# EAGLE board Schematic_BG96_Mega2560 (EAGLE 9.5.2), part 1 of 2
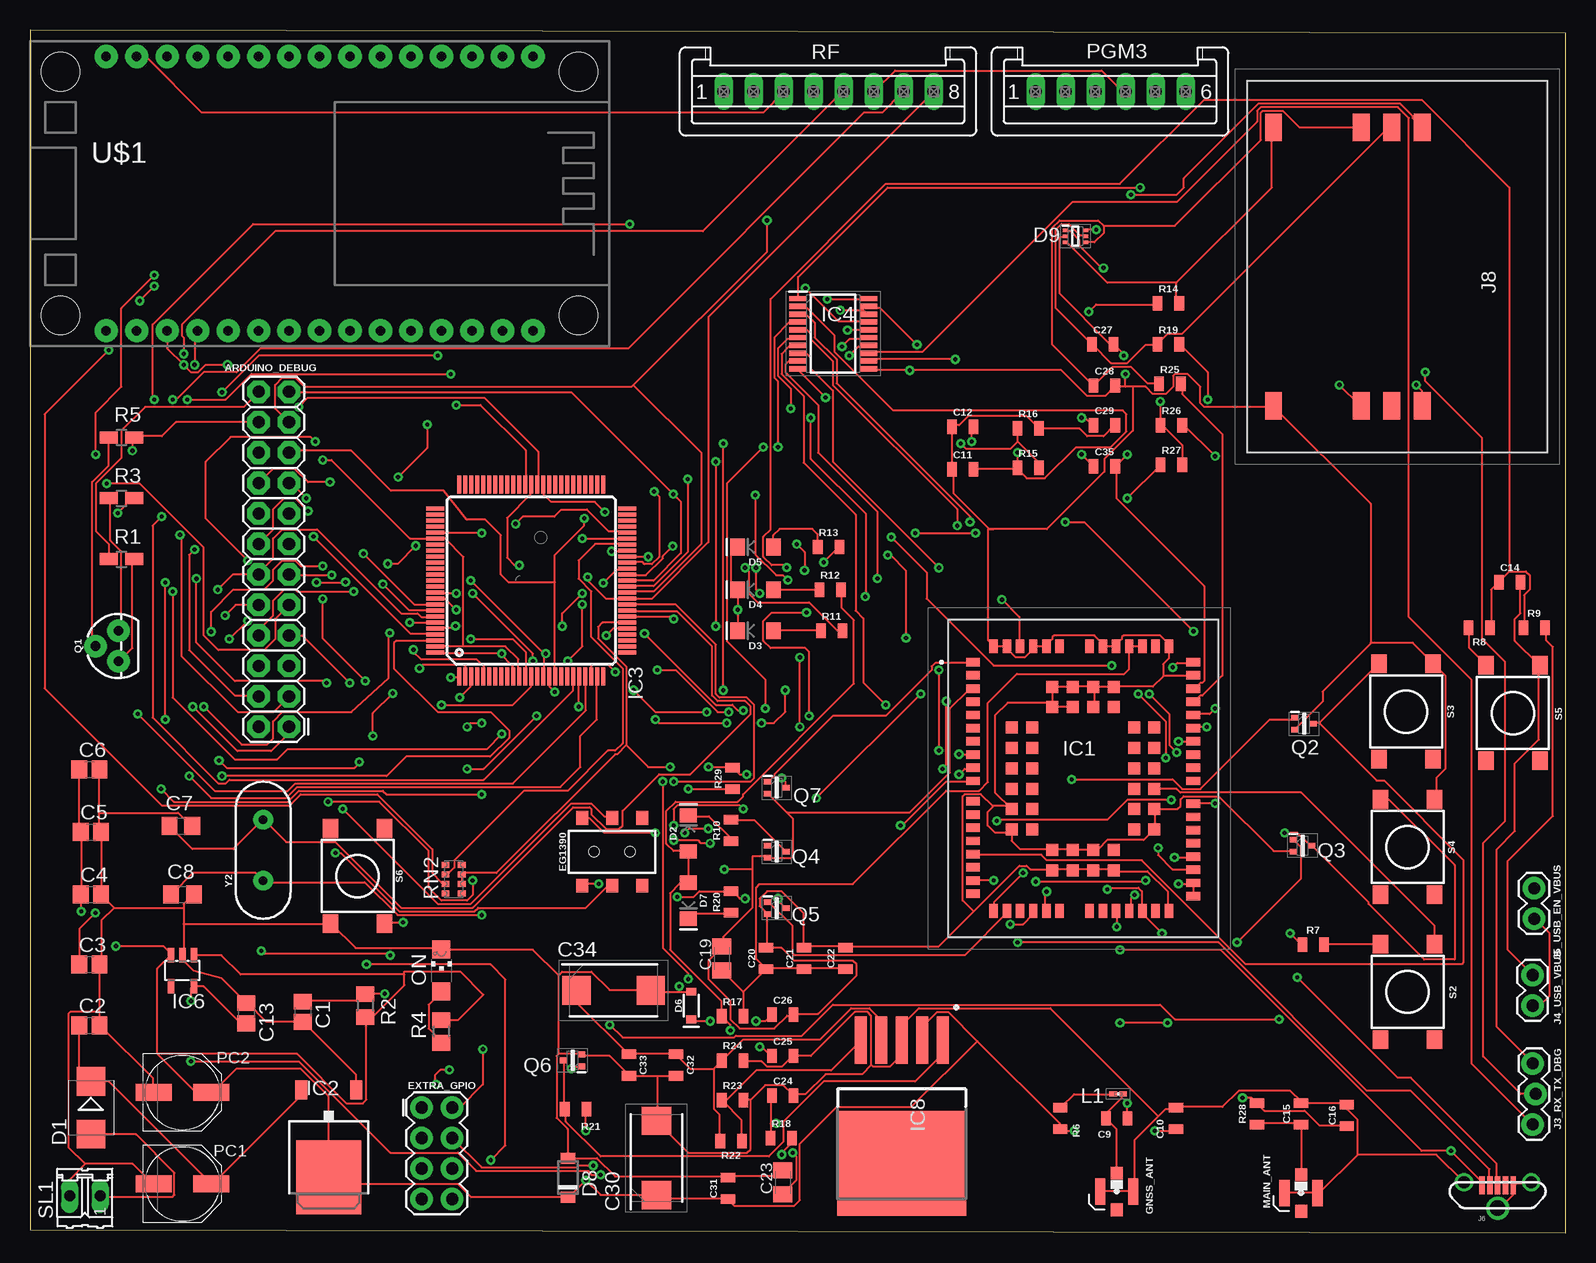
[diagram p2: board, top side]
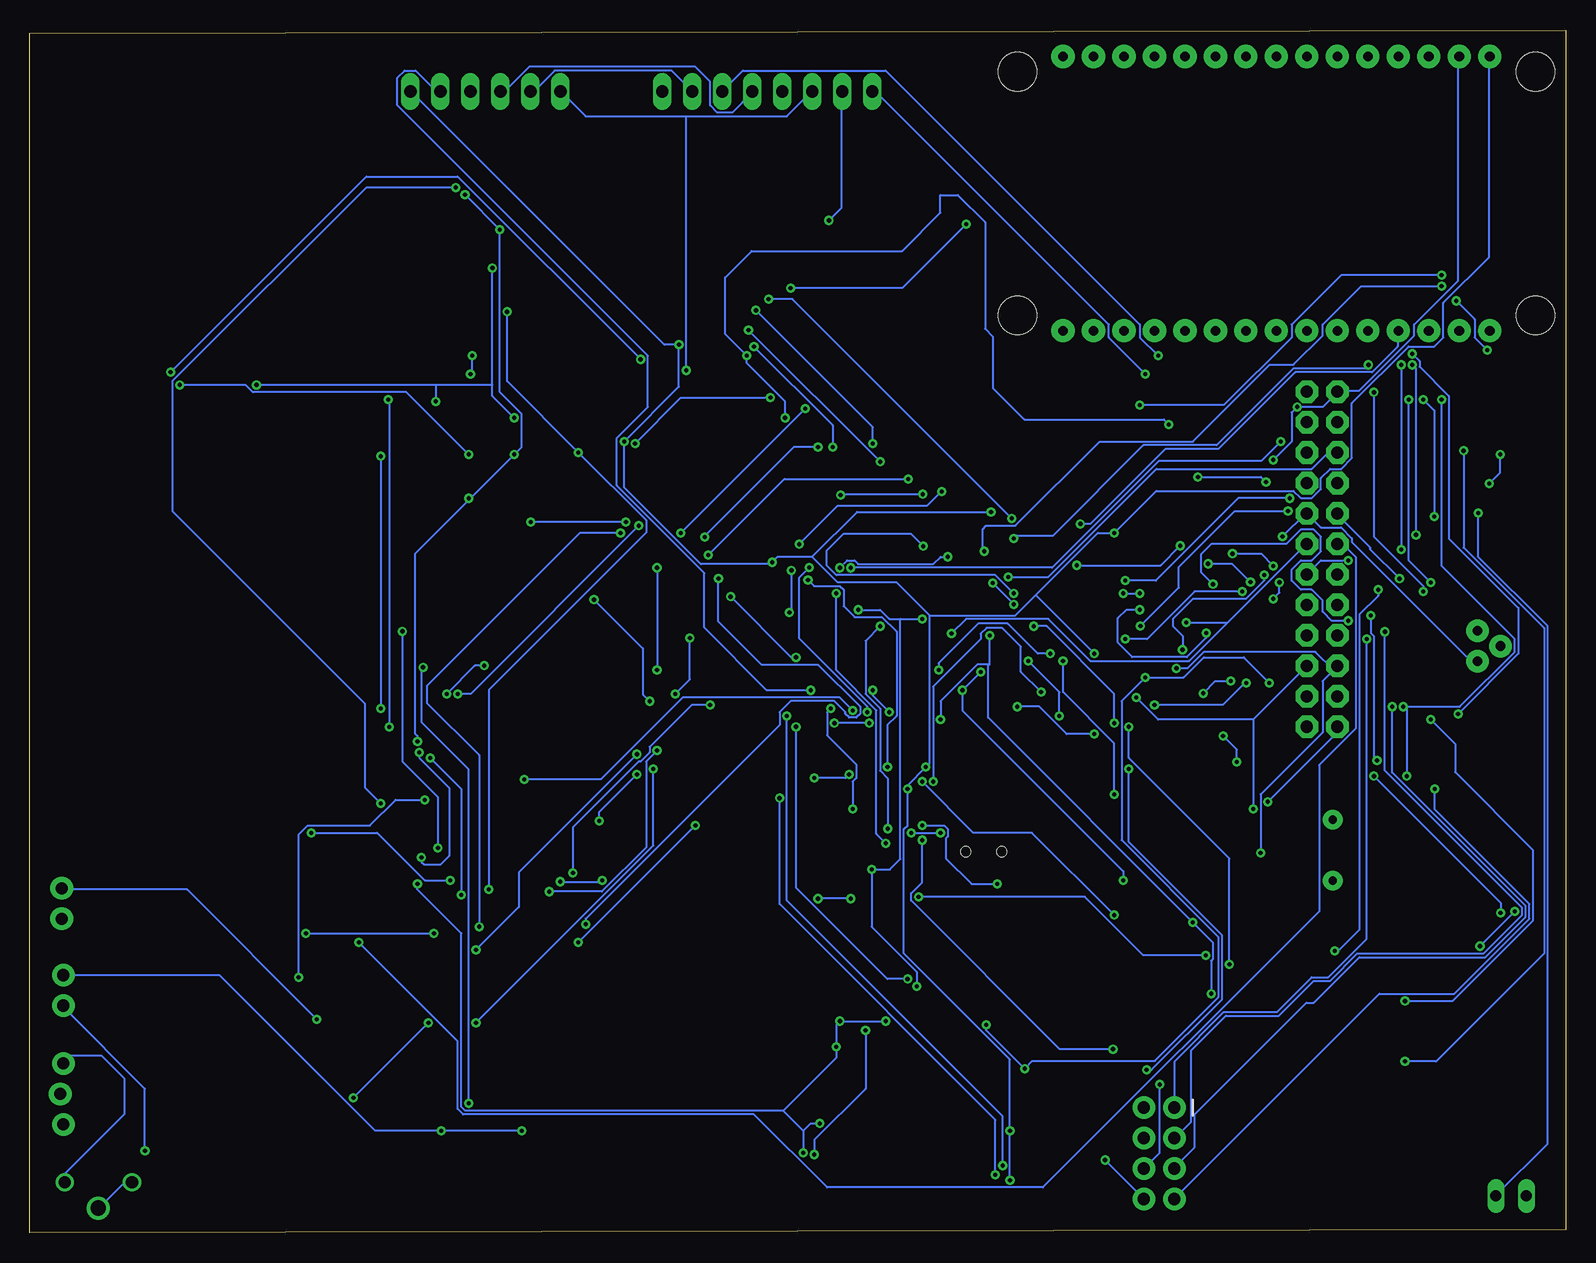
[diagram p3: board, bottom side, seen from below]

Size 128 x 100.25 mm. Coordinates in mm from the lower left corner, seen from the top.
Outline: 0,0.25 128,0 128,100 0,100.25 0,0.25
Copper layers (1*16): Top 0.035mm / dielectric 1.5mm / Bottom 0.035mm
Design rules "default *": minimum track width 6mil, minimum drill 0.35mm, track to track 6mil, track to pad 6mil, pad to pad 6mil, via to via 6mil, smd to smd 6mil, copper to edge 40mil, drill to drill 6mil, minimum pad ring 10mil, minimum via ring 8mil, stop-mask expansion 4mil, vias tented up to drill 0mil, thermal gap 10mil

## Footprints (pad centres in the part's own frame; a part is rotated, then mirrored left to right if it is on the bottom)
2X12 = drill 1.016 pad 1.88 octagon: 1 0,0; 2 0,2.54; 3 2.54,0; 4 2.54,2.54; 5 5.08,0; 6 5.08,2.54; 7 7.62,0; 8 7.62,2.54; 9 10.16,0; 10 10.16,2.54; 11 12.7,0; 12 12.7,2.54; 13 15.24,0; 14 15.24,2.54; 15 17.78,0; 16 17.78,2.54; 17 20.32,0; 18 20.32,2.54; 19 22.86,0; 20 22.86,2.54; 21 25.4,0; 22 25.4,2.54; 23 27.94,0; 24 27.94,2.54
C0805 = smd 1.3 x 1.5: 1 -0.85,0; 2 0.85,0
C0805' = smd 1.3 x 1.5: 1 -0.95,0; 2 0.95,0
0805 = smd 0.8 x 1.2: 1 -0.9,0; 2 0.9,0
C0805K = smd 1.3 x 1.6: 1 -1,0; 2 1,0
CAPPM7343X310N = smd 2.35 x 2.45: 1 -3.1,0; 2 3.1,0
SMB = smd 2.4 x 2.4: A 2.2,0; C -2.2,0
LED-1206 = smd 1.2 x 1.4: A -1.5,0; C 1.5,0
SOD-323 = smd 0.63 x 0.83: A 1.15,0; C -1.15,0
SOD123FL = smd 0.91 x 1.22: A 1.625,0; C -1.625,0
SOTFL50P160X60-6N = smd 0.475 x 0.3: 1 -0.838,0.5; 2 -0.838,0; 3 -0.838,-0.5; 4 0.838,-0.5; 5 0.838,0; 6 0.838,0.5
SWITCH_DPDT_SMD_AYZ0202 = smd 1 x 1.15: 1 -2.5,2.825; 2 0,2.825; 3 2.5,2.825; 4 -2.5,-2.825; 5 0,-2.825; 6 2.5,-2.825 | hole 0.85: 1.5,0; -1.5,0
2X4 = drill 1.016 pad 1.88: 1 -3.81,-1.27; 2 -3.81,1.27; 3 -1.27,-1.27; 4 -1.27,1.27; 5 1.27,-1.27; 6 1.27,1.27; 7 3.81,-1.27; 8 3.81,1.27
U.FL = smd 2.2 x 0.85: 1 0,1.375; 2 0,-1.375 | smd 1.05 x 1: FEED 1.525,0; NC -1.525,0
BG96MA = smd 1.15 x 0.7: 1 -9.18,9.7; 2 -9.18,8.6; 3 -9.18,7.5; 4 -9.18,6.4; 5 -9.18,5.3; 6 -9.18,4.2; 7 -9.18,3.1; 8 -9.18,2; 9 -9.18,0.9; 10 -9.18,-0.2; 11 -9.18,-1.9; 12 -9.18,-3; 13 -9.18,-4.1; 14 -9.18,-5.2; 15 -9.18,-6.3; 16 -9.18,-7.4; 17 -9.18,-8.5; 18 -9.18,-9.6; 32 9.18,-9.8; 33 9.18,-8.7; 34 9.18,-7.6; 35 9.18,-6.5; 36 9.18,-5.4; 37 9.18,-4.3; 38 9.18,-3.2; 39 9.18,-2.1; 40 9.18,-0.2; 41 9.18,0.9; 42 9.18,2; 43 9.18,3.1; 44 9.18,4.2; 45 9.18,5.3; 46 9.18,6.4; 47 9.18,7.5; 48 9.18,8.6; 49 9.18,9.7 | smd 0.7 x 1.15: 19 -7.45,-11.025; 20 -6.35,-11.025; 21 -5.25,-11.025; 22 -4.15,-11.025; 23 -3.05,-11.025; 24 -1.95,-11.025; 25 0.55,-11.025; 26 1.65,-11.025; 27 2.75,-11.025; 28 3.85,-11.025; 29 4.95,-11.025; 30 6.05,-11.025; 31 7.15,-11.025; 50 7.15,11.025; 51 6.05,11.025; 52 4.95,11.025; 53 3.85,11.025; 54 2.75,11.025; 55 1.65,11.025; 56 0.55,11.025; 57 -1.95,11.025; 58 -3.05,11.025; 59 -4.15,11.025; 60 -5.25,11.025; 61 -6.35,11.025; 62 -7.45,11.025 | smd 1 x 1: 63 -5.95,4.25; 64 -5.95,2.55; 65 -5.95,0.85; 66 -5.95,-0.85; 67 -5.95,-2.55; 68 -5.95,-4.25; 69 -2.55,-7.65; 70 -0.85,-7.65; 71 0.85,-7.65; 72 2.55,-7.65; 73 5.95,-4.25; 74 5.95,-2.55; 75 5.95,-0.85; 76 5.95,0.85; 77 5.95,2.55; 78 5.95,4.25; 79 2.55,7.65; 80 0.85,7.65; 81 -0.85,7.65; 82 -2.55,7.65; 83 -4.25,4.25; 84 -4.25,2.55; 85 -4.25,0.85; 86 -4.25,-0.85; 87 -4.25,-2.55; 88 -4.25,-4.25; 89 -2.55,-5.95; 90 -0.85,-5.95; 91 0.85,-5.95; 92 2.55,-5.95; 93 4.25,-4.25; 94 4.25,-2.55; 95 4.25,-0.85; 96 4.25,0.85; 97 4.25,2.55; 98 4.25,4.25; 99 2.55,5.95; 100 0.85,5.95; 101 -0.85,5.95; 102 -2.55,5.95
DPACK = smd 1 x 1.6: 1 -2.28,-4.8; 3 2.28,-4.8 | smd 5.4 x 6.2: 2 0,2.5
TQFP100 = smd 1.5 x 0.35: 1 -8,6; 2 -8,5.5; 3 -8,5; 4 -8,4.5; 5 -8,4; 6 -8,3.5; 7 -8,3; 8 -8,2.5; 9 -8,2; 10 -8,1.5; 11 -8,1; 12 -8,0.5; 13 -8,0; 14 -8,-0.5; 15 -8,-1; 16 -8,-1.5; 17 -8,-2; 18 -8,-2.5; 19 -8,-3; 20 -8,-3.5; 21 -8,-4; 22 -8,-4.5; 23 -8,-5; 24 -8,-5.5; 25 -8,-6; 51 8,-6; 52 8,-5.5; 53 8,-5; 54 8,-4.5; 55 8,-4; 56 8,-3.5; 57 8,-3; 58 8,-2.5; 59 8,-2; 60 8,-1.5; 61 8,-1; 62 8,-0.5; 63 8,0; 64 8,0.5; 65 8,1; 66 8,1.5; 67 8,2; 68 8,2.5; 69 8,3; 70 8,3.5; 71 8,4; 72 8,4.5; 73 8,5; 74 8,5.5; 75 8,6 | smd 0.35 x 1.5: 26 -6,-8; 27 -5.5,-8; 28 -5,-8; 29 -4.5,-8; 30 -4,-8; 31 -3.5,-8; 32 -3,-8; 33 -2.5,-8; 34 -2,-8; 35 -1.5,-8; 36 -1,-8; 37 -0.5,-8; 38 0,-8; 39 0.5,-8; 40 1,-8; 41 1.5,-8; 42 2,-8; 43 2.5,-8; 44 3,-8; 45 3.5,-8; 46 4,-8; 47 4.5,-8; 48 5,-8; 49 5.5,-8; 50 6,-8; 76 6,8; 77 5.5,8; 78 5,8; 79 4.5,8; 80 4,8; 81 3.5,8; 82 3,8; 83 2.5,8; 84 2,8; 85 1.5,8; 86 1,8; 87 0.5,8; 88 0,8; 89 -0.5,8; 90 -1,8; 91 -1.5,8; 92 -2,8; 93 -2.5,8; 94 -3,8; 95 -3.5,8; 96 -4,8; 97 -4.5,8; 98 -5,8; 99 -5.5,8; 100 -6,8
SOP65P640X120-20N = smd 1.475 x 0.45: 1 -2.938,2.925; 2 -2.938,2.275; 3 -2.938,1.625; 4 -2.938,0.975; 5 -2.938,0.325; 6 -2.938,-0.325; 7 -2.938,-0.975; 8 -2.938,-1.625; 9 -2.938,-2.275; 10 -2.938,-2.925; 11 2.938,-2.925; 12 2.938,-2.275; 13 2.938,-1.625; 14 2.938,-0.975; 15 2.938,-0.325; 16 2.938,0.325; 17 2.938,0.975; 18 2.938,1.625; 19 2.938,2.275; 20 2.938,2.925
SOT23-DBV = smd 0.55 x 1.2: 1 -0.95,-1.3; 2 0,-1.3; 3 0.95,-1.3; 4 0.95,1.3; 5 -0.95,1.3
6-PIN-TO-263 = smd 3.95 x 1: 1 -13.25,-1.93; 2 -13.25,-3.632; 3 -13.25,-5.334; 4 -13.25,-7.036; 5 -13.25,-8.738 | smd 8.75 x 10.75: 6 -3,-5.334
1X03_LOCK = drill 1.016 pad 1.88: 1 0,0.127; 2 2.54,-0.127; 3 5.08,0.127
1X02 = drill 1.016 pad 1.88: 1 0,0; 2 2.54,0
USB-B-MICRO-SMD_VERT = smd 0.45 x 1.5: D+ 0,0; D- -0.65,0; GND 1.3,0; ID 0.65,0; VBUS -1.3,0 | drill 1.016: P1 -2.8,0.25; P2 2.8,0.25 | drill 1.27: P3 0,-1.9
MOLEX-912283001 = smd 2.3 x 1.4: C8(GND) 11.6,-10.3; CLK -11.6,-2.98; GND 11.6,2.1; I/O 11.6,-2.98; PRSNC -11.6,-10.3; RST -11.6,-0.44; VCC -11.6,2.1; VPP 11.6,-0.44
INDC0603X33N = smd 0.65 x 0.4: 1 -0.4,0; 2 0.4,0
CHIPLED_1206 = smd 1.5 x 1.5: A 0,-1.75; C 0,1.75
PANASONIC_D = smd 3 x 1.4: + 2.4,0; - -2.4,0
S06P = drill 1.016 long: 1 6.25,0; 2 3.75,0; 3 1.25,0; 4 -1.25,0; 5 -3.75,0; 6 -6.25,0
TO-92-EZ = drill 0.813 pad 1.88: 1 -1.27,0; 2 0,1.905; 3 1.27,0
SOTFL50P160X85-3N = smd 0.64 x 0.48: 1 -0.75,0.5; 2 -0.75,-0.5; 3 0.75,0
R0805W = smd 1.5 x 1: 1 -1.052,0; 2 1.052,0
R0805 = smd 1.3 x 1.5: 1 -0.95,0; 2 0.95,0
S08P = drill 1.016 long: 1 8.75,0; 2 6.25,0; 3 3.75,0; 4 1.25,0; 5 -1.25,0; 6 -3.75,0; 7 -6.25,0; 8 -8.75,0
CAT16 = smd 0.5 x 0.65: 1 -1.2,-0.675; 2 -0.4,-0.675; 3 0.4,-0.675; 4 1.2,-0.675; 5 1.2,0.675; 6 0.4,0.675; 7 -0.4,0.675; 8 -1.2,0.675
TACTILE_SWITCH_SMD_6.2MM_TALL = smd 1.55 x 1.3: A1 -3.975,-2.25; A2 3.975,-2.25; B1 -3.975,2.25; B2 3.975,2.25
02P = drill 0.914 long: 1 -1.27,0; 2 1.27,0
ESP12E_DEVKIT = drill 0.8 pad 1.93: 3V3@0 -11.43,-7.62; 3V3@1 11.43,5.08; 3V3@2 11.43,-17.78; AD0 -11.43,17.78; CLK -11.43,-2.54; CMD -11.43,2.54; D0 11.43,17.78; D1 11.43,15.24; D2 11.43,12.7; D3 11.43,10.16; D4 11.43,7.62; D5 11.43,0; D6 11.43,-2.54; D7 11.43,-5.08; D8 11.43,-7.62; EN -11.43,-10.16; GND@0 -11.43,-5.08; GND@1 -11.43,-15.24; GND@2 11.43,2.54; GND@3 11.43,-15.24; RST -11.43,-12.7; RSV@0 -11.43,15.24; RSV@1 -11.43,12.7; RX 11.43,-10.16; SD0 -11.43,0; SD1 -11.43,5.08; SD2 -11.43,7.62; SD3 -11.43,10.16; TX 11.43,-12.7; VIN -11.43,-17.78 | hole 3.2: -10.16,21.59; 10.16,21.59; 10.16,-21.59; -10.16,-21.59
HC49US = drill 0.7 pad 1.651: 1 -2.54,0; 2 2.54,0

## Placement (x,y rotation side)
ARDUINO_DEBUG  CONN_12X2  [2X12]  21.59,42.16 90 top
C1  22p  [C0805]  22.73,18.42 270 top
C2  100n  [C0805]  4.95,17.27 0 top
C3  100n  [C0805]  4.95,22.35 0 top
C4  100n  [C0805]  5.08,28.19 0 top
C5  100n  [C0805]  5.08,33.4 0 top
C6  100n  [C0805]  4.95,38.61 0 top
C7  22pF  [C0805']  12.57,33.91 0 top
C8  22pF  [C0805']  12.7,28.19 0 top
C9  100pF  [0805]  90.55,9.53 0 top
C10  0.1µF  [0805]  95.5,9.53 90 top
C11  0.1µF  [0805]  77.72,63.63 0 top
C12  0.1µF  [0805]  77.72,67.18 0 top
C13  100n  [C0805]  18.03,18.29 270 top
C14  0.1µF  [0805]  123.32,54.23 0 top
C15  0.1µF  [0805]  105.92,9.91 90 top
C16  0.1µF  [0805]  109.73,9.78 90 top
C19  100µF  [C0805K]  57.66,22.86 90 top
C20  0.1µF  [0805]  61.34,22.86 90 top
C21  33pF  [0805]  64.52,22.86 90 top
C22  10pF  [0805]  67.94,22.86 90 top
C23  100µF  [C0805K]  62.74,4.19 90 top
C24  0.1µF  [0805]  62.74,11.43 0 top
C25  33pF  [0805]  62.74,14.73 0 top
C26  10pF  [0805]  62.74,18.16 0 top
C27  33pF  [0805]  89.41,74.04 0 top
C28  33pF  [0805]  89.53,70.61 0 top
C29  33pF  [0805]  89.53,67.31 0 top
C30  470µF  [CAPPM7343X310N]  52.2,6.22 90 top
C31  100nF  [0805]  58.17,3.68 90 top
C32  10pF  [0805]  53.85,13.97 270 top
C33  33pF  [0805]  49.91,13.97 270 top
C34  470µF  [CAPPM7343X310N]  48.64,20.19 0 top
C35  100nF  [0805]  89.53,63.88 0 top
D1  M7  [SMB]  5.08,10.41 270 top
D2  BLUE  [LED-1206]  54.86,33.27 90 top
D3  BLUE  [LED-1206]  60.45,50.16 180 top
D4  GREEN  [LED-1206]  60.45,53.59 180 top
D5  RED  [LED-1206]  60.45,57.15 180 top
D6  5.1V  [SOD-323]  55.12,18.92 90 top
D7  RED  [LED-1206]  54.86,27.69 270 top
D8  TVS_5V  [SOD123FL]  44.83,4.57 90 top
D9  ESDA6V8AV6  [SOTFL50P160X60-6N]  87.12,83.06 0 top
EG1390  [SWITCH_DPDT_SMD_AYZ0202]  48.51,31.75 0 top
EXTRA_GPIO  [2X4]  33.91,6.6 270 top
GNSS_ANT  U.FL  [U.FL]  90.55,3.43 90 top
IC1  BG96MA  [BG96MA]  87.76,37.85 0 top
IC2  MC33269D-5.0  [DPACK]  24.89,7.11 180 top
IC3  ATMEGA2560-16AU  [TQFP100]  41.78,54.36 90 top
IC4  TXS0108PWR  [SOP65P640X120-20N]  66.93,74.93 0 top
IC6  LP2985-33DBVR  [SOT23-DBV]  12.7,21.84 180 top
IC8  MIC29302WU  [6-PIN-TO-263]  77.98,2.79 270 top
J3_RX_TX_DBG  [1X03_LOCK]  125.35,9.02 90 top
J4_USB_VBUS  [1X02]  125.22,18.92 90 top
J5_USB_EN_VBUS  [1X02]  125.35,26.16 90 top
J6  WM9734TR-ND  [USB-B-MICRO-SMD_VERT]  122.3,3.94 0 top
J8  MOLEX-91228-3001  [MOLEX-912283001]  113.92,80.52 270 top
L1  MLG0603P47NH  [INDC0603X33N]  90.68,11.56 0 top
MAIN_ANT  U.FL  [U.FL]  105.92,3.3 90 top
ON  GREEN  [CHIPLED_1206]  34.29,21.84 0 top
PC1  47u  [PANASONIC_D]  12.7,4.06 0 top
PC2  47u  [PANASONIC_D]  12.7,11.68 0 top
PGM3  [S06P]  90.04,95.12 180 top
Q1  200mA/40V  [TO-92-EZ]  7.37,48.89 90 top
Q2  DTC043ZE  [SOTFL50P160X85-3N]  106.17,42.42 0 top
Q3  DTC043ZE  [SOTFL50P160X85-3N]  106.05,32.26 0 top
Q4  DTC043ZE  [SOTFL50P160X85-3N]  62.23,31.75 0 top
Q5  DTC043ZE  [SOTFL50P160X85-3N]  62.23,27.05 0 top
Q6  DTC143ZEBTL  [SOTFL50P160X85-3N]  45.21,14.35 180 top
Q7  DTC043ZE  [SOTFL50P160X85-3N]  62.23,37.08 0 top
R1  22K  [R0805W]  7.62,56.13 0 top
R2  10K  [R0805]  27.94,18.92 270 top
R3  10K  [R0805W]  7.62,61.21 0 top
R4  1K  [R0805]  34.29,16.76 90 top
R5  10K  [R0805W]  7.62,66.29 0 top
R6  10E  [0805]  85.85,9.53 90 top
R7  10K  [0805]  106.93,24 0 top
R8  1K  [0805]  120.78,50.42 180 top
R9  10K  [0805]  125.35,50.42 0 top
R10  1K  [0805]  58.42,33.53 90 top
R11  1K  [0805]  66.8,50.16 0 top
R12  1K  [0805]  66.67,53.59 0 top
R13  1K  [0805]  66.55,57.15 0 top
R14  51K  [0805]  94.87,77.47 0 top
R15  15K  [0805]  83.19,63.75 0 top
R16  120K  [0805]  83.19,67.06 0 top
R17  0E  [0805]  58.55,18.03 0 top
R18  0E  [0805]  62.61,7.87 0 top
R19  0E  [0805]  94.87,74.04 0 top
R20  1K  [0805]  58.42,27.56 90 top
R21  51K  [0805]  45.47,10.29 180 top
R22  100K  [0805]  58.42,7.62 180 top
R23  47K  [0805]  58.55,11.05 0 top
R24  470E  [0805]  58.55,14.35 180 top
R25  0E  [0805]  95,70.74 0 top
R26  0E  [0805]  95.12,67.31 0 top
R27  15K  [0805]  95.12,64.01 0 top
R28  0E  [0805]  102.23,9.91 90 top
R29  10K  [0805]  58.55,37.85 90 top
RF  [S08P]  66.55,95.12 180 top
RN2  10K  [CAT16]  35.31,29.46 270 top
S2  USB_BOOT_SMD-6.2  [TACTILE_SWITCH_SMD_6.2MM_TALL]  114.81,20.07 90 top
S3  PWR_KEY_SMD-6.2  [TACTILE_SWITCH_SMD_6.2MM_TALL]  114.68,43.43 90 top
S4  RST_SMD-6.2  [TACTILE_SWITCH_SMD_6.2MM_TALL]  114.81,32.13 90 top
S5  USR_SMD-6.2  [TACTILE_SWITCH_SMD_6.2MM_TALL]  123.57,43.31 90 top
S6  ARD_RST  [TACTILE_SWITCH_SMD_6.2MM_TALL]  27.3,29.72 270 top
SL1  [02P]  4.57,3.05 180 top
U$1  ESP12E_DEVKIT  [ESP12E_DEVKIT]  24.13,86.61 270 top
Y2  16MHz  [HC49US]  19.43,31.88 270 top